# EAGLE schematic main_board_v1_2 (EAGLE 9.2.2)

## Sheet 1 of 8: MCU
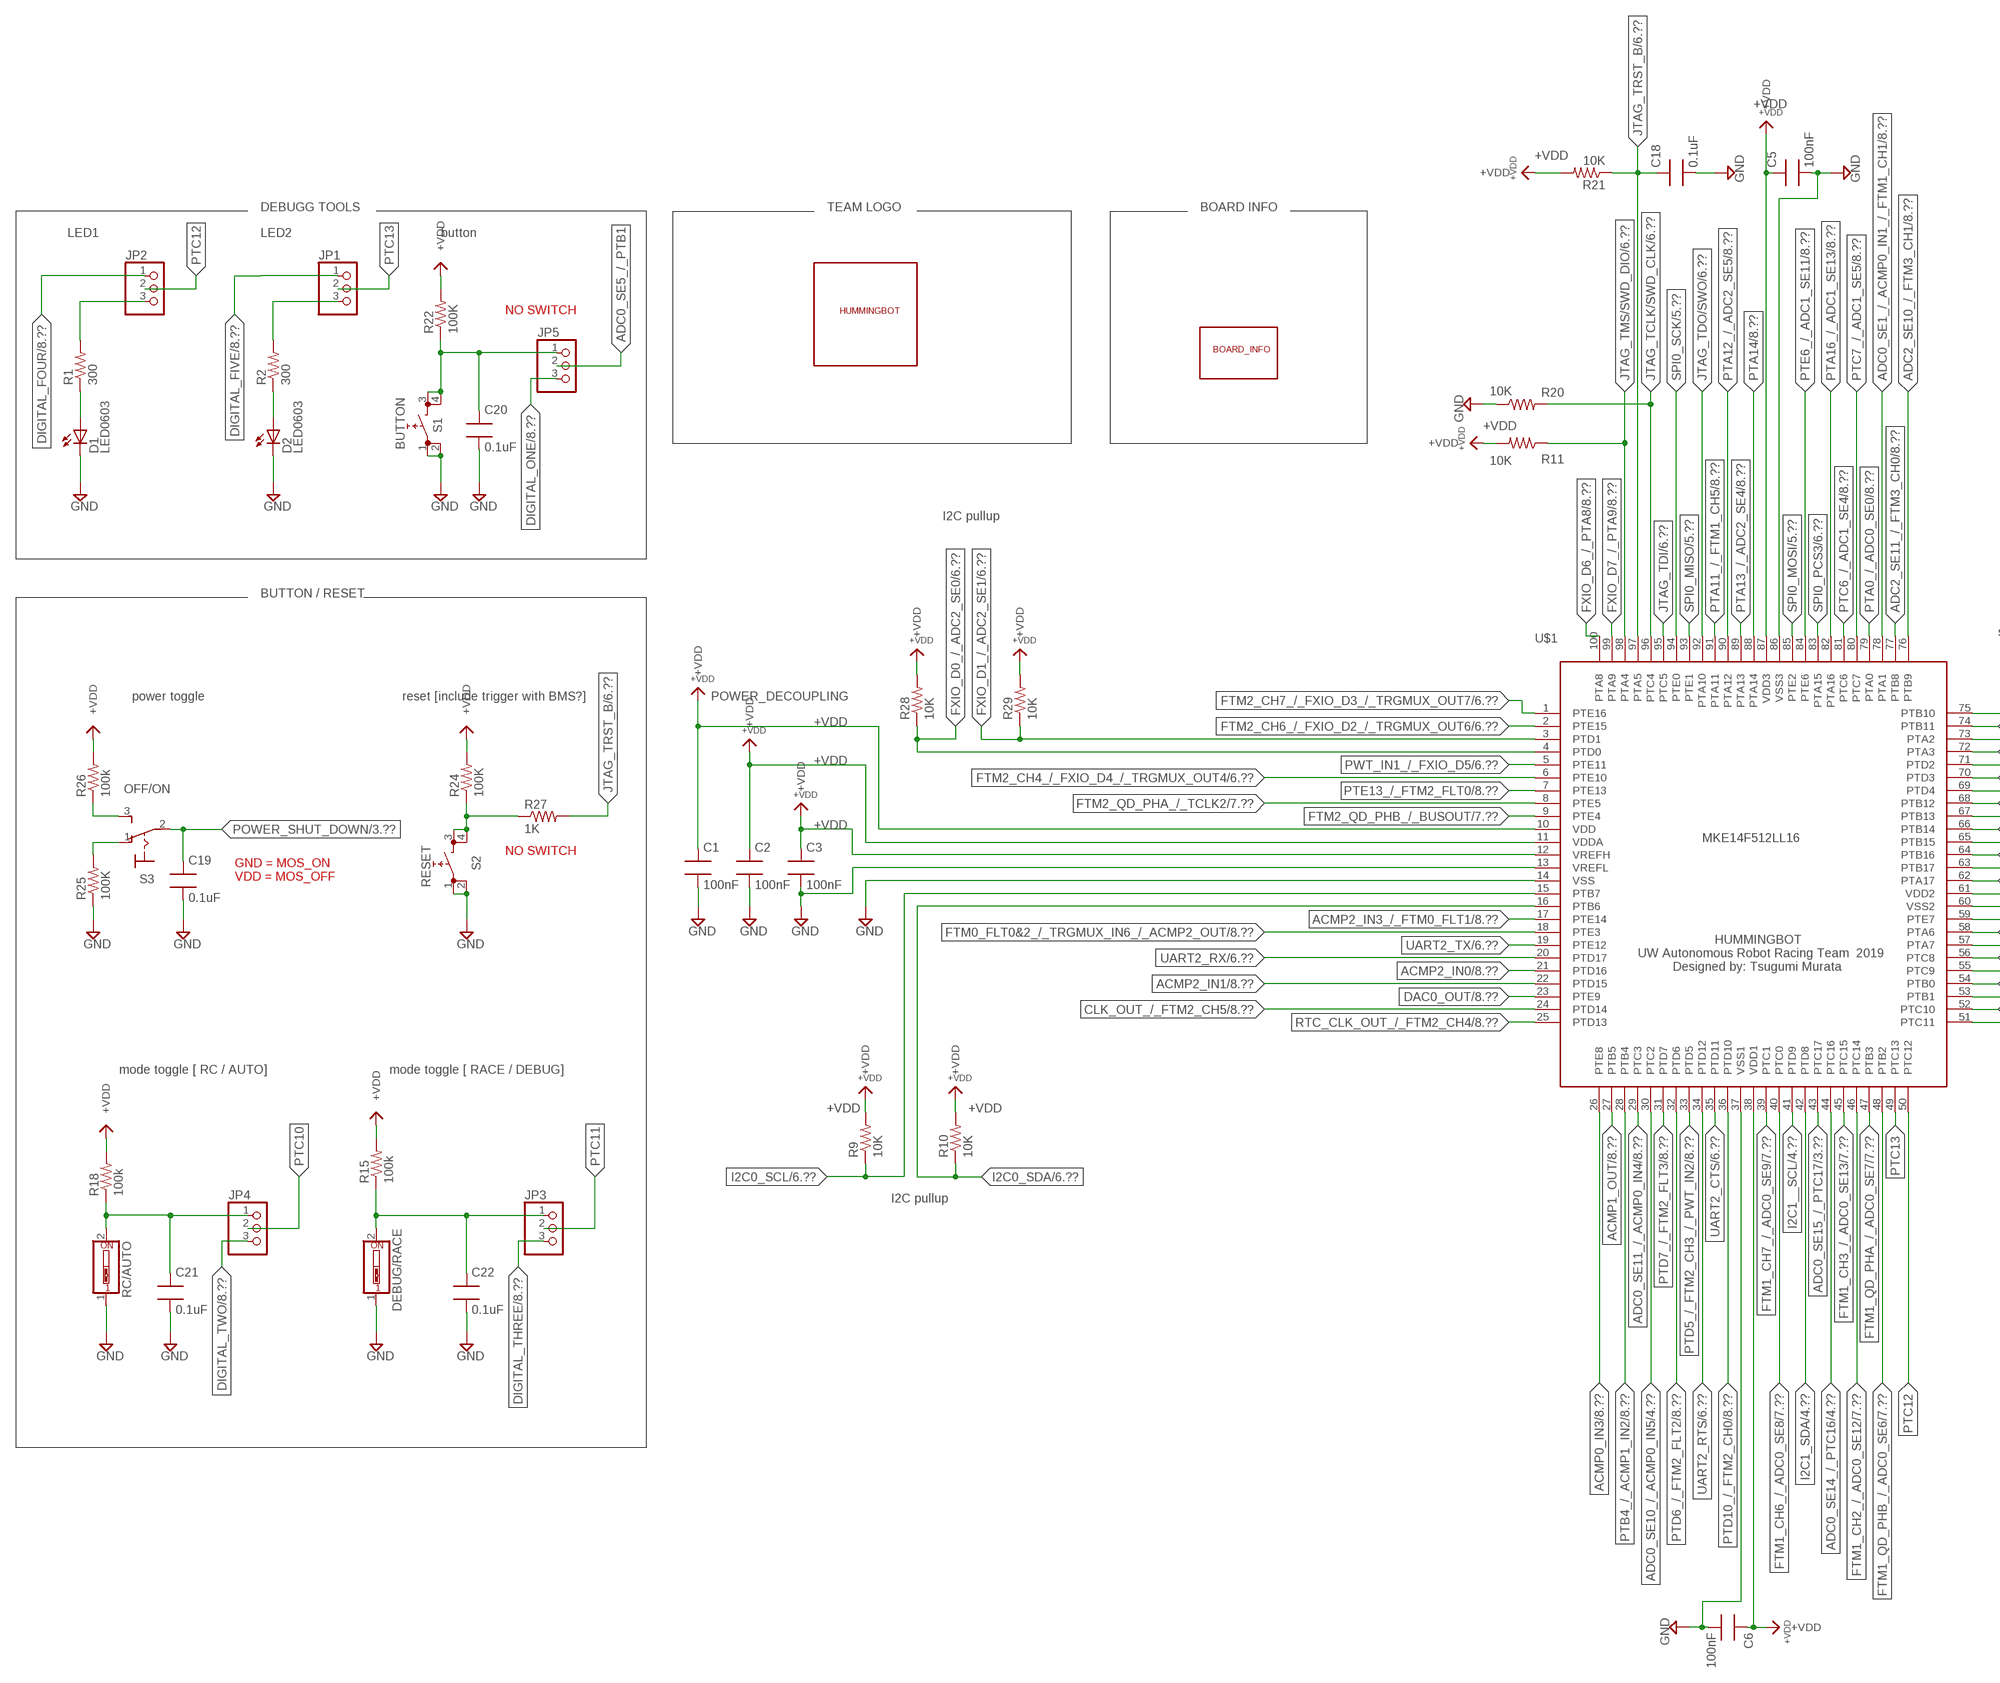
[diagram p0: schematic, sheet 1, part 1 of 2]
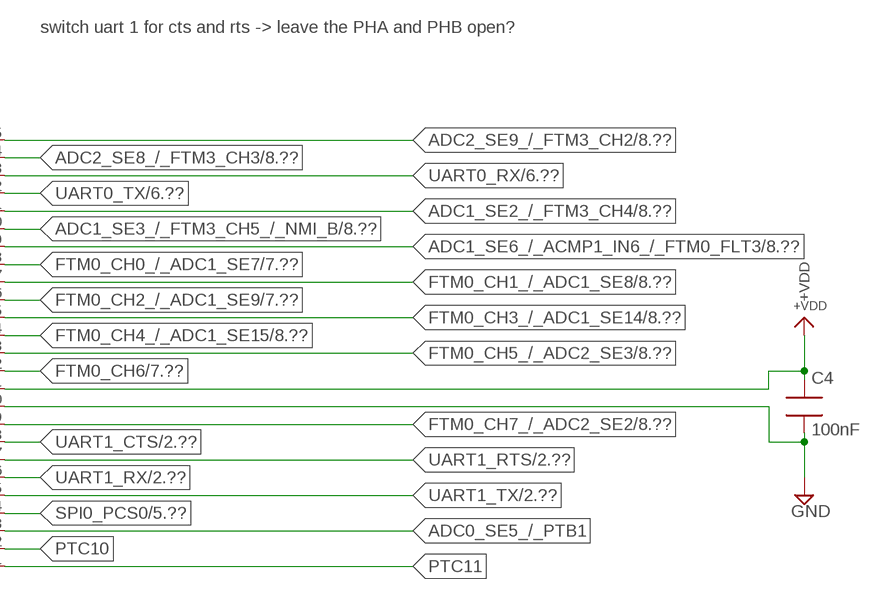
[diagram p1: schematic, sheet 1, part 2 of 2]

### Parts
C1  100nF  CAP0603  [0603SMT]
C2  100nF  CAP0603  [0603SMT]
C3  100nF  CAP0603  [0603SMT]
C4  100nF  CAP0603  [0603SMT]
C5  100nF  CAP0603  [0603SMT]
C6  100nF  CAP0603  [0603SMT]
C18  0.1uF  CAP0603  [0603SMT]
C19  0.1uF  CAP0603  [0603SMT]
C20  0.1uF  CAP0603  [0603SMT]
C21  0.1uF  CAP0603  [0603SMT]
C22  0.1uF  CAP0603  [0603SMT]
D1  LED0603  [0603SMT]
D2  LED0603  [0603SMT]
DEBUG/RACE  SW_DIP-1  [EDG-01]
JP1  PINHD-1X3  [1X03]
JP2  PINHD-1X3  [1X03]
JP3  PINHD-1X3  [1X03]
JP4  PINHD-1X3  [1X03]
JP5  PINHD-1X3  [1X03]
R1  300  RES0603  [0603SMT]
R2  300  RES0603  [0603SMT]
R9  10K  RES0603  [0603SMT]
R10  10K  RES0603  [0603SMT]
R11  10K  RES0603  [0603SMT]
R15  100k  RES0603  [0603SMT]
R18  100k  RES0603  [0603SMT]
R20  10K  RES0603  [0603SMT]
R21  10K  RES0603  [0603SMT]
R22  100K  RES0603  [0603SMT]
R24  100K  RES0603  [0603SMT]
R25  100K  RES0603  [0603SMT]
R26  100k  RES0603  [0603SMT]
R27  1K  RES0603  [0603SMT]
R28  10K  RES0603  [0603SMT]
R29  10K  RES0603  [0603SMT]
RC/AUTO  SW_DIP-1  [EDG-01]
S1  BUTTON  TACT_SWITCH_6X6_SMT  [TACT_SWITCH_SMT]
S2  RESET  TACT_SWITCH_6X6_SMT  [TACT_SWITCH_SMT]
S3  OFF/ON  M9040P  [M9040P]
U$1  MKE14F512LL16  [LQFP100]
U$38  BOARD_INFO  [BOARD_INFO]
U$44  TEAM_LOGO  [TEAM_LOGO]

### Nets
+VDD: C1.1 C2.1 C3.1 C4.1 C5.1 C6.1 R9.2 R10.2 R11.2 R15.2 R18.2 R21.2 R22.2 R24.2 R26.2 R28.2 R29.2 U$1.10(VDD) U$1.11(VDDA) U$1.12(VREFH) U$1.38(VDD1) U$1.61(VDD2) U$1.87(VDD3) ; also sheet 3,4,5,6,7,8
ACMP0_IN3: U$1.26(PTE8) ; also sheet 8
ACMP1_OUT: U$1.27(PTB5) ; also sheet 8
ACMP2_IN0: U$1.21(PTD16) ; also sheet 8
ACMP2_IN1: U$1.22(PTD15) ; also sheet 8
ACMP2_IN3_/_FTM0_FLT1: U$1.17(PTE14) ; also sheet 8
ADC0_SE1_/_ACMP0_IN1_/_FTM1_CH1: U$1.78(PTA1) ; also sheet 8
ADC0_SE5_/_PTB1: JP5.2 U$1.53(PTB1)
ADC0_SE10_/_ACMP0_IN5: U$1.30(PTC2) ; also sheet 4,8
ADC0_SE11_/_ACMP0_IN4: U$1.29(PTC3) ; also sheet 8
ADC0_SE14_/_PTC16: U$1.44(PTC16) ; also sheet 4,8
ADC0_SE15_/_PTC17: U$1.43(PTC17) ; also sheet 3,8
ADC1_SE2_/_FTM3_CH4: U$1.71(PTD2) ; also sheet 8
ADC1_SE3_/_FTM3_CH5_/_NMI_B: U$1.70(PTD3) ; also sheet 8
ADC1_SE6_/_ACMP1_IN6_/_FTM0_FLT3: U$1.69(PTD4) ; also sheet 8
ADC2_SE8_/_FTM3_CH3: U$1.74(PTB11) ; also sheet 8
ADC2_SE9_/_FTM3_CH2: U$1.75(PTB10) ; also sheet 8
ADC2_SE10_/_FTM3_CH1: U$1.76(PTB9) ; also sheet 8
ADC2_SE11_/_FTM3_CH0: U$1.77(PTB8) ; also sheet 8
CLK_OUT_/_FTM2_CH5: U$1.24(PTD14) ; also sheet 8
DAC0_OUT: U$1.23(PTE9) ; also sheet 8
DIGITAL_FIVE: JP1.1 ; also sheet 8
DIGITAL_FOUR: JP2.1 ; also sheet 8
DIGITAL_ONE: JP5.3 ; also sheet 8
DIGITAL_THREE: JP3.3 ; also sheet 8
DIGITAL_TWO: JP4.3 ; also sheet 8
FTM0_CH0_/_ADC1_SE7: U$1.68(PTB12) ; also sheet 7,8
FTM0_CH1_/_ADC1_SE8: U$1.67(PTB13) ; also sheet 8
FTM0_CH2_/_ADC1_SE9: U$1.66(PTB14) ; also sheet 7,8
FTM0_CH3_/_ADC1_SE14: U$1.65(PTB15) ; also sheet 8
FTM0_CH4_/_ADC1_SE15: U$1.64(PTB16) ; also sheet 8
FTM0_CH5_/_ADC2_SE3: U$1.63(PTB17) ; also sheet 8
FTM0_CH6: U$1.62(PTA17) ; also sheet 7,8
FTM0_CH7_/_ADC2_SE2: U$1.59(PTE7) ; also sheet 8
FTM0_FLT0&2_/_TRGMUX_IN6_/_ACMP2_OUT: U$1.18(PTE3) ; also sheet 8
FTM1_CH2_/_ADC0_SE12: U$1.46(PTC14) ; also sheet 7
FTM1_CH3_/_ADC0_SE13: U$1.45(PTC15) ; also sheet 7
FTM1_CH6_/_ADC0_SE8: U$1.40(PTC0) ; also sheet 7
FTM1_CH7_/_ADC0_SE9: U$1.39(PTC1) ; also sheet 7
FTM1_QD_PHA_/_ADC0_SE7: U$1.47(PTB3) ; also sheet 7
FTM1_QD_PHB_/_ADC0_SE6: U$1.48(PTB2) ; also sheet 7
FTM2_CH4_/_FXIO_D4_/_TRGMUX_OUT4: U$1.6(PTE10) ; also sheet 6,8
FTM2_CH6_/_FXIO_D2_/_TRGMUX_OUT6: U$1.2(PTE15) ; also sheet 6,8
FTM2_CH7_/_FXIO_D3_/_TRGMUX_OUT7: U$1.1(PTE16) ; also sheet 6,8
FTM2_QD_PHA_/_TCLK2: U$1.8(PTE5) ; also sheet 7
FTM2_QD_PHB_/_BUSOUT: U$1.9(PTE4) ; also sheet 7
FXIO_D0_/_ADC2_SE0: R28.1 U$1.4(PTD0) ; also sheet 6,8
FXIO_D1_/_ADC2_SE1: R29.1 U$1.3(PTD1) ; also sheet 6,8
FXIO_D6_/_PTA8: U$1.100(PTA8) ; also sheet 8
FXIO_D7_/_PTA9: U$1.99(PTA9) ; also sheet 8
GND: C1.2 C2.2 C3.2 C4.2 C5.2 C6.2 C18.2 C19.2 C20.2 C21.2 C22.2 D1.2(C) D2.2(C) DEBUG/RACE.1 R20.1 R25.1 RC/AUTO.1 S1.1 S1.2 S2.1 S2.2 U$1.13(VREFL) U$1.14(VSS) U$1.37(VSS1) U$1.60(VSS2) U$1.86(VSS3) ; also sheet 2,3,4,6,7,8
I2C0_SCL: R9.1 U$1.15(PTB7) ; also sheet 6
I2C0_SDA: R10.1 U$1.16(PTB6) ; also sheet 6
I2C1__SCL: U$1.41(PTD9) ; also sheet 4
I2C1_SDA: U$1.42(PTD8) ; also sheet 4
JTAG_TCLK/SWD_CLK: R20.2 U$1.96(PTC4) ; also sheet 6
JTAG_TDI: U$1.95(PTC5) ; also sheet 6
JTAG_TDO/SWO: U$1.92(PTA10) ; also sheet 6
JTAG_TMS/SWD_DIO: R11.1 U$1.98(PTA4) ; also sheet 6
JTAG_TRST_B: C18.1 R21.1 R27.2 U$1.97(PTA5) ; also sheet 6
N$3: D1.1(A) R1.1
N$5: D2.1(A) R2.1
N$6: JP1.3 R2.2
N$7: JP2.3 R1.2
N$19: R24.1 R27.1 S2.3 S2.4
N$26: C22.1 DEBUG/RACE.2 JP3.1 R15.1
N$31: C21.1 JP4.1 R18.1 RC/AUTO.2
N$41: C20.1 JP5.1 R22.1 S1.3 S1.4
N$45: R26.1 S3.3(S)
N$46: R25.2 S3.1(O)
POWER_SHUT_DOWN: C19.1 S3.2(P) ; also sheet 3
PTA0_/_ADC0_SE0: U$1.79(PTA0) ; also sheet 8
PTA11_/_FTM1_CH5: U$1.91(PTA11) ; also sheet 8
PTA12_/_ADC2_SE5: U$1.90(PTA12) ; also sheet 8
PTA13_/_ADC2_SE4: U$1.89(PTA13) ; also sheet 8
PTA14: U$1.88(PTA14) ; also sheet 8
PTA16_/_ADC1_SE13: U$1.82(PTA16) ; also sheet 8
PTB4_/_ACMP1_IN2: U$1.28(PTB4) ; also sheet 8
PTC6_/_ADC1_SE4: U$1.81(PTC6) ; also sheet 8
PTC7_/_ADC1_SE5: U$1.80(PTC7) ; also sheet 8
PTC10: JP4.2 U$1.52(PTC10)
PTC11: JP3.2 U$1.51(PTC11)
PTC12: JP2.2 U$1.50(PTC12)
PTC13: JP1.2 U$1.49(PTC13)
PTD5_/_FTM2_CH3_/_PWT_IN2: U$1.33(PTD5) ; also sheet 8
PTD6_/_FTM2_FLT2: U$1.32(PTD6) ; also sheet 8
PTD7_/_FTM2_FLT3: U$1.31(PTD7) ; also sheet 8
PTD10_/_FTM2_CH0: U$1.36(PTD10) ; also sheet 8
PTE6_/_ADC1_SE11: U$1.84(PTE6) ; also sheet 8
PTE13_/_FTM2_FLT0: U$1.7(PTE13) ; also sheet 8
PWT_IN1_/_FXIO_D5: U$1.5(PTE11) ; also sheet 6,8
RTC_CLK_OUT_/_FTM2_CH4: U$1.25(PTD13) ; also sheet 8
SPI0_MISO: U$1.93(PTE1) ; also sheet 5,6
SPI0_MOSI: U$1.85(PTE2) ; also sheet 5,6
SPI0_PCS0: U$1.54(PTB0) ; also sheet 5
SPI0_PCS3: U$1.83(PTA15) ; also sheet 6
SPI0_SCK: U$1.94(PTE0) ; also sheet 5,6
UART0_RX: U$1.73(PTA2) ; also sheet 6
UART0_TX: U$1.72(PTA3) ; also sheet 6
UART1_CTS: U$1.58(PTA6) ; also sheet 2
UART1_RTS: U$1.57(PTA7) ; also sheet 2
UART1_RX: U$1.56(PTC8) ; also sheet 2
UART1_TX: U$1.55(PTC9) ; also sheet 2
UART2_CTS: U$1.35(PTD11) ; also sheet 6
UART2_RTS: U$1.34(PTD12) ; also sheet 6
UART2_RX: U$1.20(PTD17) ; also sheet 6
UART2_TX: U$1.19(PTE12) ; also sheet 6

### Notes on the sheet
- DEBUGG TOOLS | TEAM LOGO | BOARD INFO
- LED1 | LED2 | button
- NO SWITCH
- I2C pullup
- BUTTON / RESET
- switch uart 1 for cts and rts -> leave the PHA and PHB open?
- power toggle | reset [include trigger with BMS?] | POWER_DECOUPLING
- NO SWITCH
- GND = MOS_ON 
  VDD = MOS_OFF
- HUMMINGBOT 
  UW Autonomous Robot Racing Team  2019 
            Designed by: Tsugumi Murata
- mode toggle [ RC / AUTO] | mode toggle [ RACE / DEBUG]
- I2C pullup

## Sheet 2 of 8: USB Interface [Programming / Debug]
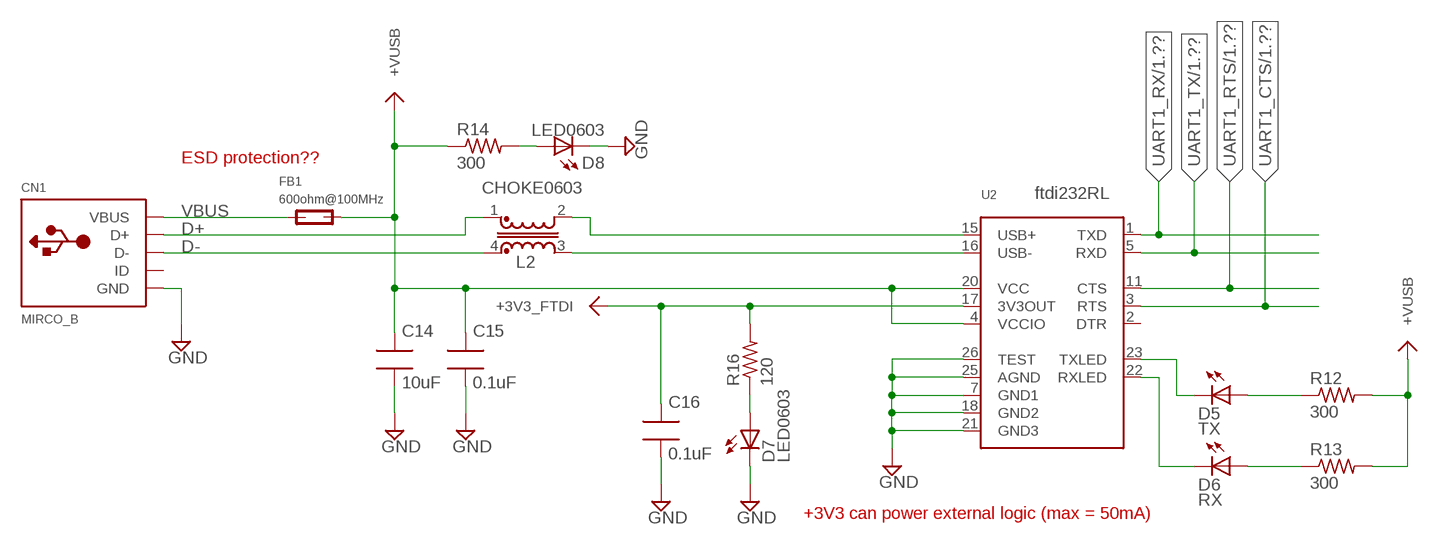
[diagram p2: schematic, sheet 2]

### Parts
C14  10uF  CAP0603  [0603SMT]
C15  0.1uF  CAP0603  [0603SMT]
C16  0.1uF  CAP0603  [0603SMT]
CN1  MIRCO_B  [MICRO-USB]
D5  TX  LED0603  [0603SMT]
D6  RX  LED0603  [0603SMT]
D7  LED0603  [0603SMT]
D8  LED0603  [0603SMT]
FB1  600ohm@100MHz  FERRITE_BEAD  [0603SMT]
L2  CHOKE0603  [CHOKE0603]
R12  300  RES0603  [0603SMT]
R13  300  RES0603  [0603SMT]
R14  300  RES0603  [0603SMT]
R16  120  RES0603  [0603SMT]
U2  FT232RLSSOP28  [SSOP28DB]

### Nets
+3V3_FTDI: C16.1 R16.2 U2.17(3V3OUT)
+VUSB: C14.1 C15.1 FB1.2 R12.2 R13.2 R14.1 U2.4(VCCIO) U2.20(VCC)
D+: CN1.3(D+) L2.1
D-: CN1.2(D-) L2.4
GND: C14.2 C15.2 C16.2 CN1.5(GND) CN1.GND1(GND) CN1.GND2(GND) D7.2(C) D8.2(C) U2.7(GND1) U2.18(GND2) U2.21(GND3) U2.25(AGND) U2.26(TEST) ; also sheet 1,3,4,6,7,8
N$1: D7.1(A) R16.1
N$2: D8.1(A) R14.2
N$12: L2.2 U2.15(USB+)
N$13: L2.3 U2.16(USB-)
N$14: D5.2(C) U2.23(TXLED)
N$15: D5.1(A) R12.1
N$17: D6.2(C) U2.22(RXLED)
N$18: D6.1(A) R13.1
UART1_CTS: U2.3(RTS) ; also sheet 1
UART1_RTS: U2.11(CTS) ; also sheet 1
UART1_RX: U2.1(TXD) ; also sheet 1
UART1_TX: U2.5(RXD) ; also sheet 1
VBUS: CN1.1(VBUS) FB1.1
Unconnected: CN1.4(ID) U2.2(DTR)

### Notes on the sheet
- ESD protection??
- ftdi232RL
- +3V3 can power external logic (max = 50mA)

## Sheet 3 of 8: POWER REGULATOR / SHUTDOWN
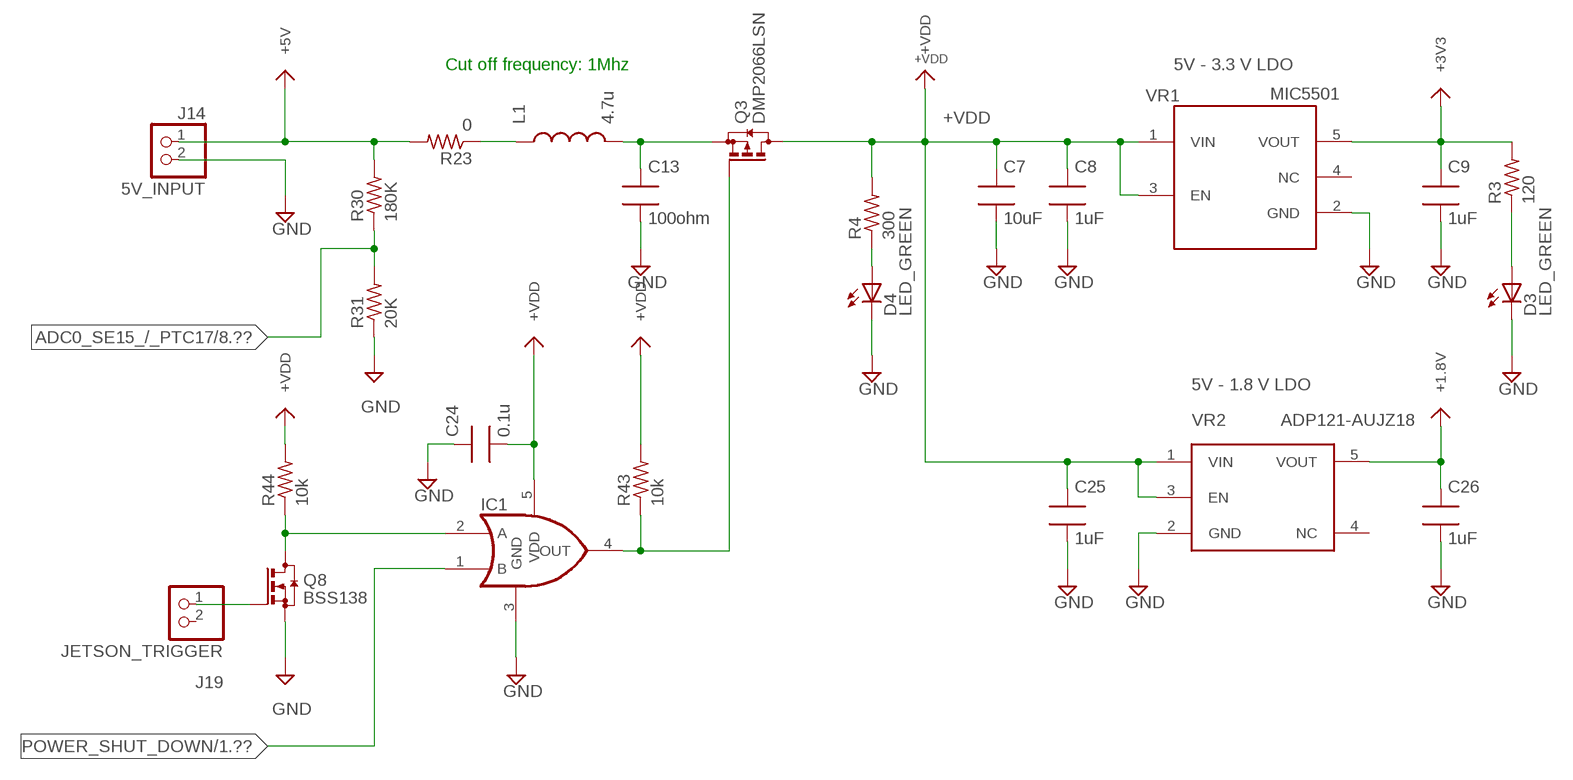
[diagram p3: schematic, sheet 3]

### Parts
C7  10uF  CAP0603  [0603SMT]
C8  1uF  CAP0603  [0603SMT]
C9  1uF  CAP0603  [0603SMT]
C13  100ohm  CAP0603  [0603SMT]
C24  0.1u  CAP0603  [0603SMT]
C25  1uF  CAP0603  [0603SMT]
C26  1uF  CAP0603  [0603SMT]
D3  LED_GREEN  LED0603  [0603SMT]
D4  LED_GREEN  LED0603  [0603SMT]
IC1  OR_SC70-5  [SC70-5]
J14  5V_INPUT  PINHEAD-2-VERTICAL  [JST_B2B-PH-K-S(LF)(SN)]
J19  JETSON_TRIGGER  PINHEAD-2-VERTICAL  [JST_B2B-PH-K-S(LF)(SN)]
L1  4.7u  IND0603  [0603SMT]
Q3  DMP2066LSN  PMOS_SOT23  [SOT23]
Q8  BSS138  NMOS_SOT23  [SOT23]
R3  120  RES0603  [0603SMT]
R4  300  RES0603  [0603SMT]
R23  0  RES0603  [0603SMT]
R30  180K  RES0603  [0603SMT]
R31  20K  RES0603  [0603SMT]
R43  10k  RES0603  [0603SMT]
R44  10k  RES0603  [0603SMT]
VR1  MIC5501  [SOT23-5]
VR2  ADP121-AUJZ18  ADP121  [TSOT23-5]

### Nets
+1.8V: C26.1 VR2.5(VOUT) ; supply symbol labelled +1V8 ; also sheet 4,6,8
+3V3: C9.1 R3.2 VR1.5(VOUT) ; also sheet 5,6,8
+5V: J14.1 R23.2 R30.2 ; also sheet 7
+VDD: C7.1 C8.1 C24.2 C25.1 IC1.5(VDD) Q3.3(D) R4.2 R43.2 R44.2 VR1.1(VIN) VR1.3(EN) VR2.1(VIN) VR2.3(EN) ; also sheet 1,4,5,6,7,8
ADC0_SE15_/_PTC17: R30.1 R31.2 ; also sheet 1,8
GND: C7.2 C8.2 C9.2 C13.2 C24.1 C25.2 C26.2 D3.2(C) D4.2(C) IC1.3(GND) J14.2 Q8.2(S) R31.1 VR1.2(GND) VR2.2(GND) ; also sheet 1,2,4,6,7,8
N$8: D3.1(A) R3.1
N$9: D4.1(A) R4.1
N$11: L1.1 R23.1
N$20: C13.1 L1.2 Q3.2(S)
N$35: J19.1 Q8.1(G)
N$38: IC1.2(A) Q8.3(D) R44.1
N$39: IC1.4(OUT) Q3.1(G) R43.1
POWER_SHUT_DOWN: IC1.1(B) ; also sheet 1
Unconnected: J19.2 VR1.4(NC) VR2.4(NC)

### Notes on the sheet
- Cut off frequency: 1Mhz | 5V - 3.3 V LDO
- 5V - 1.8 V LDO

## Sheet 4 of 8: IMU / Bi- Directional Level Shifter
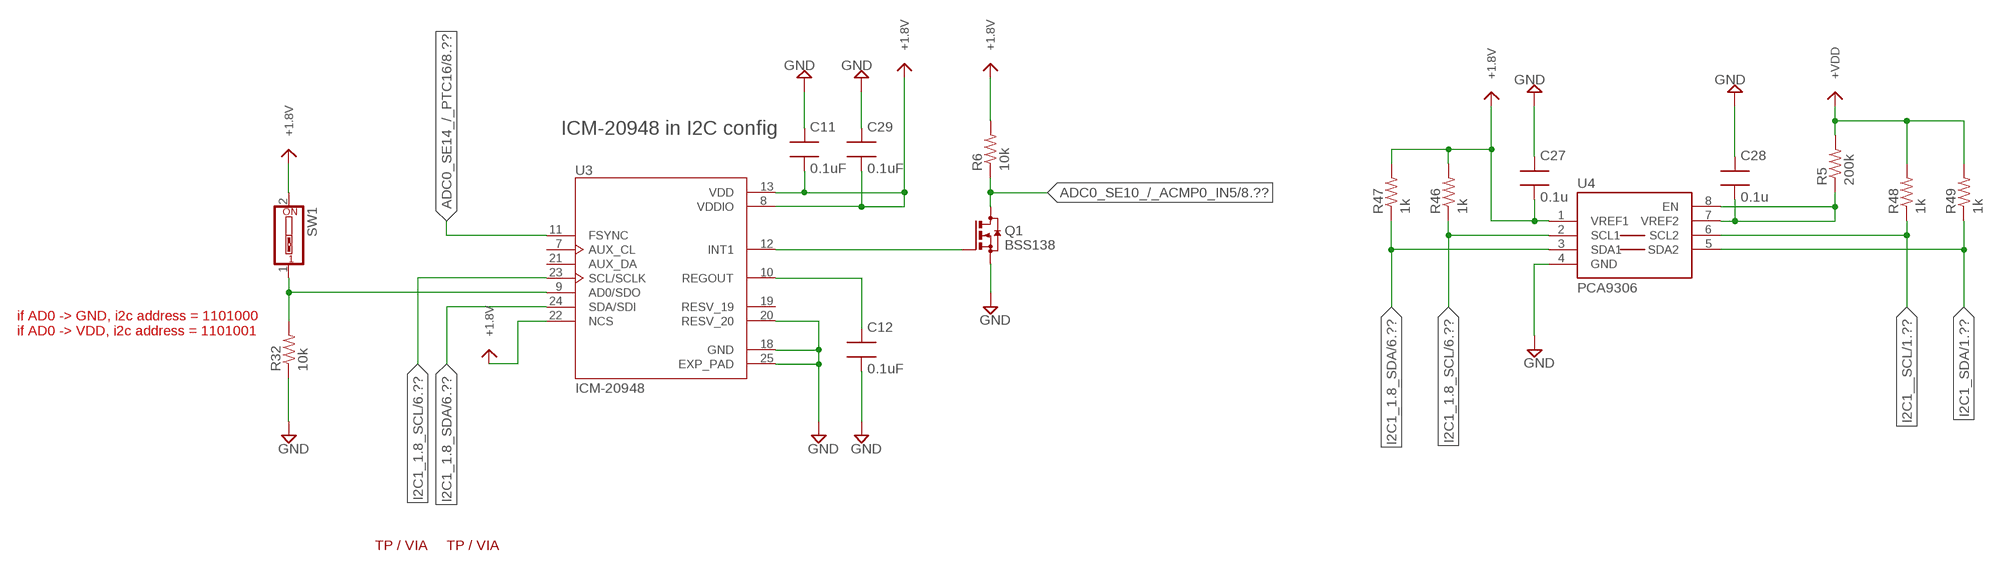
[diagram p4: schematic, sheet 4]

### Parts
C11  0.1uF  CAP0603  [0603SMT]
C12  0.1uF  CAP0603  [0603SMT]
C27  0.1u  CAP0603  [0603SMT]
C28  0.1u  CAP0603  [0603SMT]
C29  0.1uF  CAP0603  [0603SMT]
Q1  BSS138  NMOS_SOT23  [SOT23]
R5  200k  RES0603  [0603SMT]
R6  10k  RES0603  [0603SMT]
R32  10k  RES0603  [0603SMT]
R46  1k  RES0603  [0603SMT]
R47  1k  RES0603  [0603SMT]
R48  1k  RES0603  [0603SMT]
R49  1k  RES0603  [0603SMT]
SW1  SW_DIP-1  [EDG-01]
U3  ICM-20948  [QFN40P300X300X105-25N]
U4  PCA9306  [PSOP-8]

### Nets
+1.8V: C11.2 C27.2 C29.2 R6.2 R46.2 R47.2 SW1.2 U3.8(VDDIO) U3.13(VDD) U3.22(NCS) U4.1(VREF1) ; supply symbol labelled +1V8 ; also sheet 3,6,8
+VDD: R5.2 R48.2 R49.2 ; also sheet 1,3,5,6,7,8
ADC0_SE10_/_ACMP0_IN5: Q1.3(D) R6.1 ; also sheet 1,8
ADC0_SE14_/_PTC16: U3.11(FSYNC) ; also sheet 1,8
GND: C11.1 C12.2 C27.1 C28.1 C29.1 Q1.2(S) R32.1 U3.18(GND) U3.20(RESV_20) U3.25(EXP_PAD) U4.4(GND) ; also sheet 1,2,3,6,7,8
I2C1_1.8_SCL: R46.1 U3.23(SCL/SCLK) U4.2(SCL1) ; also sheet 6
I2C1_1.8_SDA: R47.1 U3.24(SDA/SDI) U4.3(SDA1) ; also sheet 6
I2C1__SCL: R48.1 U4.6(SCL2) ; also sheet 1
I2C1_SDA: R49.1 U4.5(SDA2) ; also sheet 1
N$10: C12.1 U3.10(REGOUT)
N$16: C28.2 R5.1 U4.7(VREF2) U4.8(EN)
N$22: R32.2 SW1.1 U3.9(AD0/SDO)
N$37: Q1.1(G) U3.12(INT1)
Unconnected: U3.7(AUX_CL) U3.19(RESV_19) U3.21(AUX_DA)

### Notes on the sheet
- ICM-20948 in I2C config
- if AD0 -> GND, i2c address = 1101000
  if AD0 -> VDD, i2c address = 1101001
- TP / VIA | TP / VIA

## Sheet 5 of 8: SPI Bi-directional level shifter
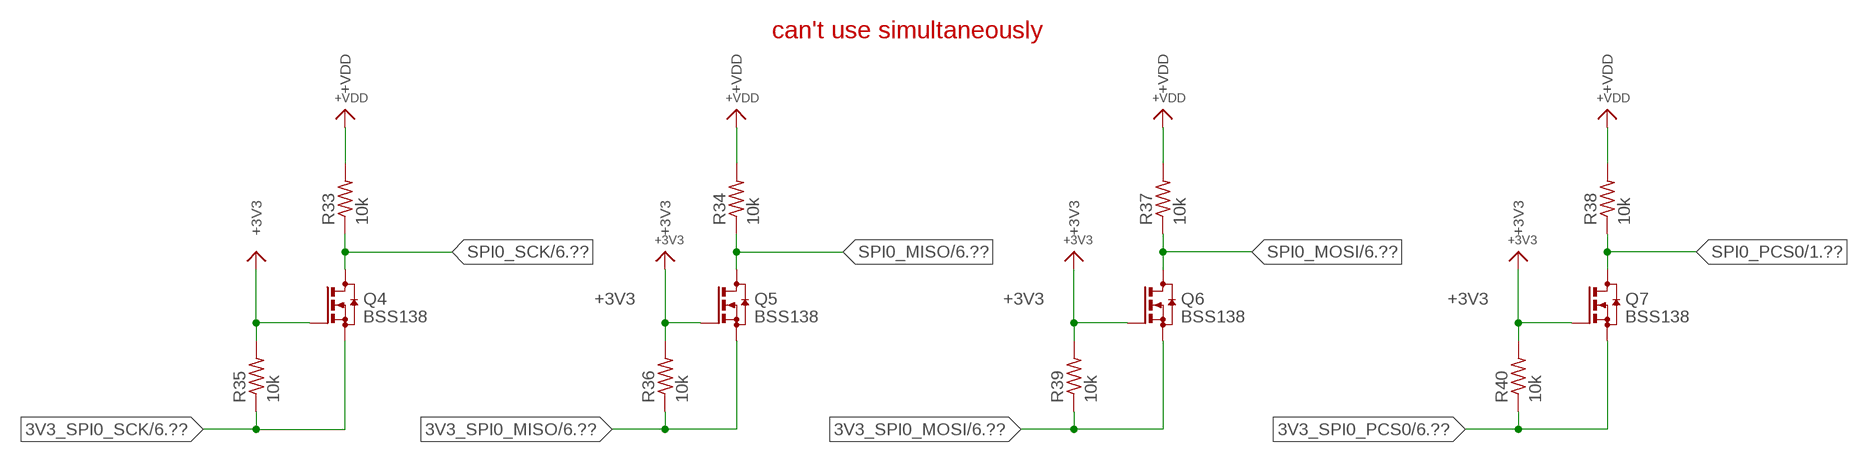
[diagram p5: schematic, sheet 5]

### Parts
Q4  BSS138  NMOS_SOT23  [SOT23]
Q5  BSS138  NMOS_SOT23  [SOT23]
Q6  BSS138  NMOS_SOT23  [SOT23]
Q7  BSS138  NMOS_SOT23  [SOT23]
R33  10k  RES0603  [0603SMT]
R34  10k  RES0603  [0603SMT]
R35  10k  RES0603  [0603SMT]
R36  10k  RES0603  [0603SMT]
R37  10k  RES0603  [0603SMT]
R38  10k  RES0603  [0603SMT]
R39  10k  RES0603  [0603SMT]
R40  10k  RES0603  [0603SMT]

### Nets
3V3_SPI0_MISO: Q5.2(S) R36.1 ; also sheet 6
3V3_SPI0_MOSI: Q6.2(S) R39.1 ; also sheet 6
3V3_SPI0_PCS0: Q7.2(S) R40.1 ; also sheet 6
3V3_SPI0_SCK: Q4.2(S) R35.1 ; also sheet 6
+3V3: Q4.1(G) Q5.1(G) Q6.1(G) Q7.1(G) R35.2 R36.2 R39.2 R40.2 ; also sheet 3,6,8
+VDD: R33.2 R34.2 R37.2 R38.2 ; also sheet 1,3,4,6,7,8
SPI0_MISO: Q5.3(D) R34.1 ; also sheet 1,6
SPI0_MOSI: Q6.3(D) R37.1 ; also sheet 1,6
SPI0_PCS0: Q7.3(D) R38.1 ; also sheet 1
SPI0_SCK: Q4.3(D) R33.1 ; also sheet 1,6

### Notes on the sheet
- can't use simultaneously

## Sheet 6 of 8: Communication ( I2C / SPI / UART / SWD / JTAG )
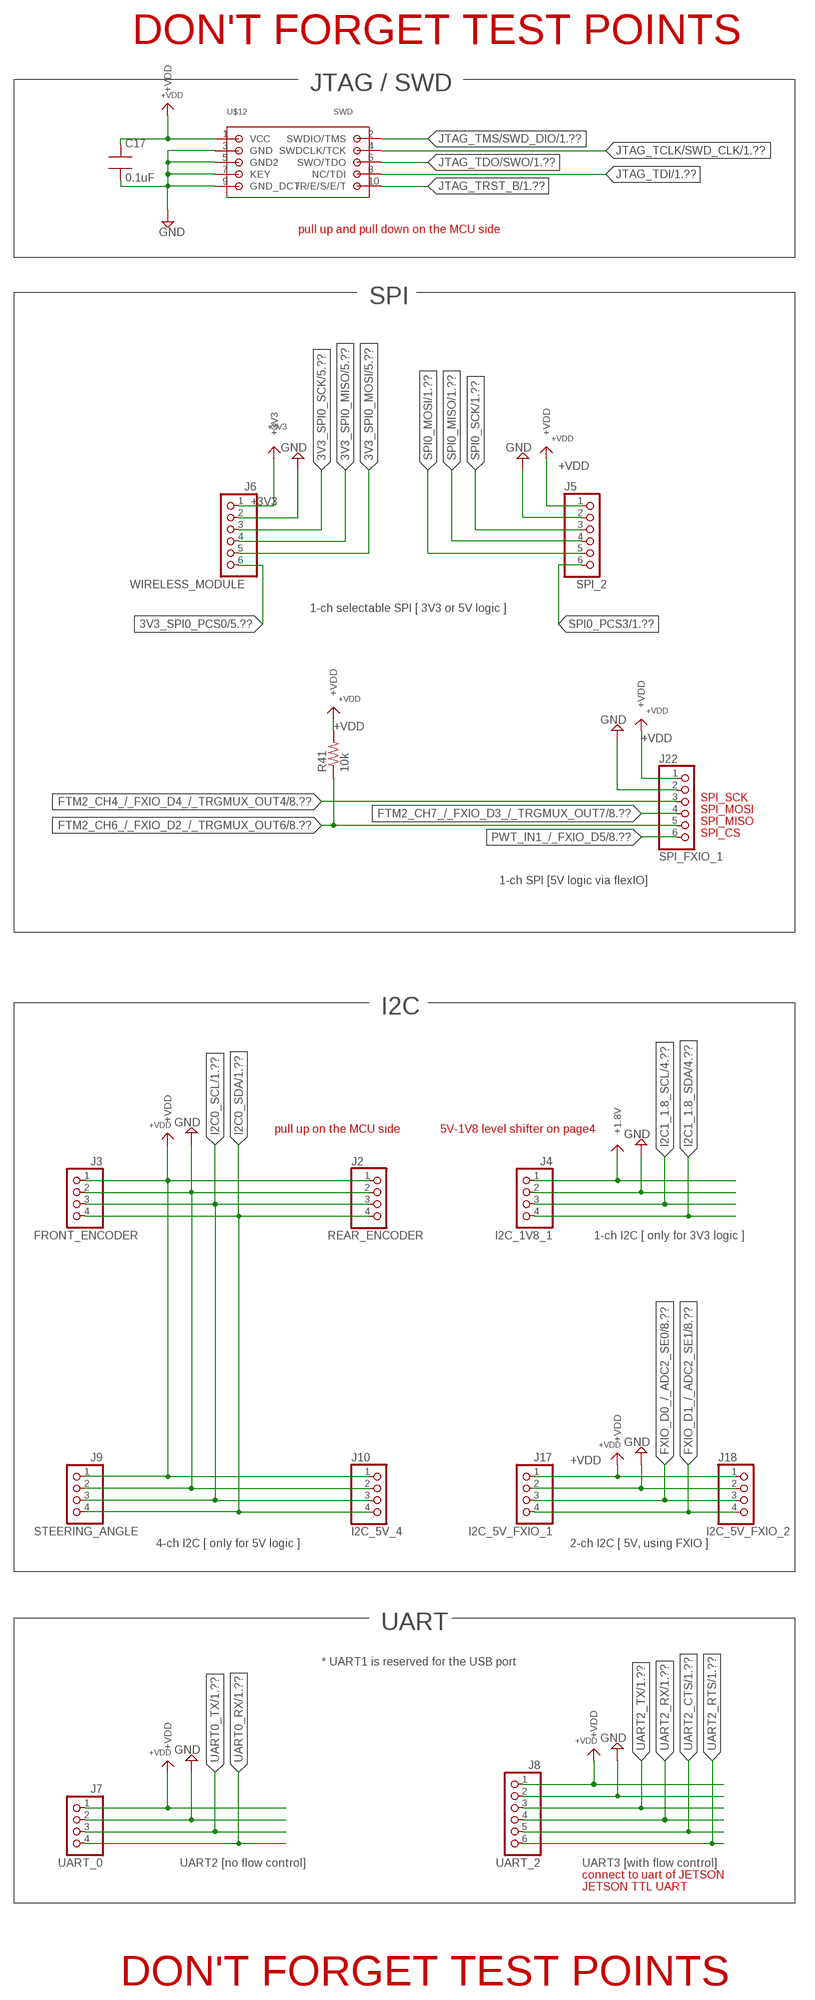
[diagram p6: schematic, sheet 6]

### Parts
C17  0.1uF  CAP0603  [0603SMT]
J2  REAR_ENCODER  PINHEAD-4-VERTICAL  [JST_B4B-PH-K-S(LF)(SN)]
J3  FRONT_ENCODER  PINHEAD-4-VERTICAL  [JST_B4B-PH-K-S(LF)(SN)]
J4  I2C_1V8_1  PINHEAD-4-VERTICAL  [JST_B4B-PH-K-S(LF)(SN)]
J5  SPI_2  PINHEAD-6-VERTICAL  [JST_B6B-PH-K-S(LF)(SN)]
J6  WIRELESS_MODULE  PINHEAD-6-VERTICAL  [JST_B6B-PH-K-S(LF)(SN)]
J7  UART_0  PINHEAD-4-VERTICAL  [JST_B4B-PH-K-S(LF)(SN)]
J8  UART_2  PINHEAD-6-VERTICAL  [JST_B6B-PH-K-S(LF)(SN)]
J9  STEERING_ANGLE  PINHEAD-4-VERTICAL  [JST_B4B-PH-K-S(LF)(SN)]
J10  I2C_5V_4  PINHEAD-4-VERTICAL  [JST_B4B-PH-K-S(LF)(SN)]
J17  I2C_5V_FXIO_1  PINHEAD-4-VERTICAL  [JST_B4B-PH-K-S(LF)(SN)]
J18  I2C_5V_FXIO_2  PINHEAD-4-VERTICAL  [JST_B4B-PH-K-S(LF)(SN)]
J22  SPI_FXIO_1  PINHEAD-6-VERTICAL  [JST_B6B-PH-K-S(LF)(SN)]
R41  10k  RES0603  [0603SMT]
U$12  SWD  SWD_1.27MM  [SWD_1.27MM]

### Nets
3V3_SPI0_MISO: J6.4 ; also sheet 5
3V3_SPI0_MOSI: J6.5 ; also sheet 5
3V3_SPI0_PCS0: J6.6 ; also sheet 5
3V3_SPI0_SCK: J6.3 ; also sheet 5
+1.8V: J4.1 ; supply symbol labelled +1V8 ; also sheet 3,4,8
+3V3: J6.1 ; also sheet 3,5,8
+VDD: C17.1 J2.1 J3.1 J5.1 J7.1 J8.1 J9.1 J10.1 J17.1 J18.1 J22.1 R41.2 U$12.1(VCC) ; also sheet 1,3,4,5,7,8
FTM2_CH4_/_FXIO_D4_/_TRGMUX_OUT4: J22.3 ; also sheet 1,8
FTM2_CH6_/_FXIO_D2_/_TRGMUX_OUT6: J22.5 R41.1 ; also sheet 1,8
FTM2_CH7_/_FXIO_D3_/_TRGMUX_OUT7: J22.4 ; also sheet 1,8
FXIO_D0_/_ADC2_SE0: J17.3 J18.3 ; also sheet 1,8
FXIO_D1_/_ADC2_SE1: J17.4 J18.4 ; also sheet 1,8
GND: C17.2 J2.2 J3.2 J4.2 J5.2 J6.2 J7.2 J8.2 J9.2 J10.2 J17.2 J18.2 J22.2 U$12.3(GND) U$12.5(GND2) U$12.7(KEY) U$12.9(GND_DCT) ; also sheet 1,2,3,4,7,8
I2C0_SCL: J2.3 J3.3 J9.3 J10.3 ; also sheet 1
I2C0_SDA: J2.4 J3.4 J9.4 J10.4 ; also sheet 1
I2C1_1.8_SCL: J4.3 ; also sheet 4
I2C1_1.8_SDA: J4.4 ; also sheet 4
JTAG_TCLK/SWD_CLK: U$12.4(SWDCLK/TCK) ; also sheet 1
JTAG_TDI: U$12.8(NC/TDI) ; also sheet 1
JTAG_TDO/SWO: U$12.6(SWO/TDO) ; also sheet 1
JTAG_TMS/SWD_DIO: U$12.2(SWDIO/TMS) ; also sheet 1
JTAG_TRST_B: U$12.10(/R/E/S/E/T) ; also sheet 1
PWT_IN1_/_FXIO_D5: J22.6 ; also sheet 1,8
SPI0_MISO: J5.4 ; also sheet 1,5
SPI0_MOSI: J5.5 ; also sheet 1,5
SPI0_PCS3: J5.6 ; also sheet 1
SPI0_SCK: J5.3 ; also sheet 1,5
UART0_RX: J7.4 ; also sheet 1
UART0_TX: J7.3 ; also sheet 1
UART2_CTS: J8.5 ; also sheet 1
UART2_RTS: J8.6 ; also sheet 1
UART2_RX: J8.4 ; also sheet 1
UART2_TX: J8.3 ; also sheet 1

### Notes on the sheet
- DON'T FORGET TEST POINTS
- JTAG / SWD
- pull up and pull down on the MCU side
- SPI
- 1-ch selectable SPI [ 3V3 or 5V logic ]
- SPI_SCK
- SPI_MOSI
- SPI_MISO
- SPI_CS
- 1-ch SPI [5V logic via flexIO]
- I2C
- pull up on the MCU side | 5V-1V8 level shifter on page4
- 1-ch I2C [ only for 3V3 logic ]
- 4-ch I2C [ only for 5V logic ] | 2-ch I2C [ 5V, using FXIO ]
- UART
- * UART1 is reserved for the USB port
- UART2 [no flow control] | UART3 [with flow control]
- connect to uart of JETSON
- JETSON TTL UART
- DON'T FORGET TEST POINTS

## Sheet 7 of 8: SENSOR / ACTUATOR
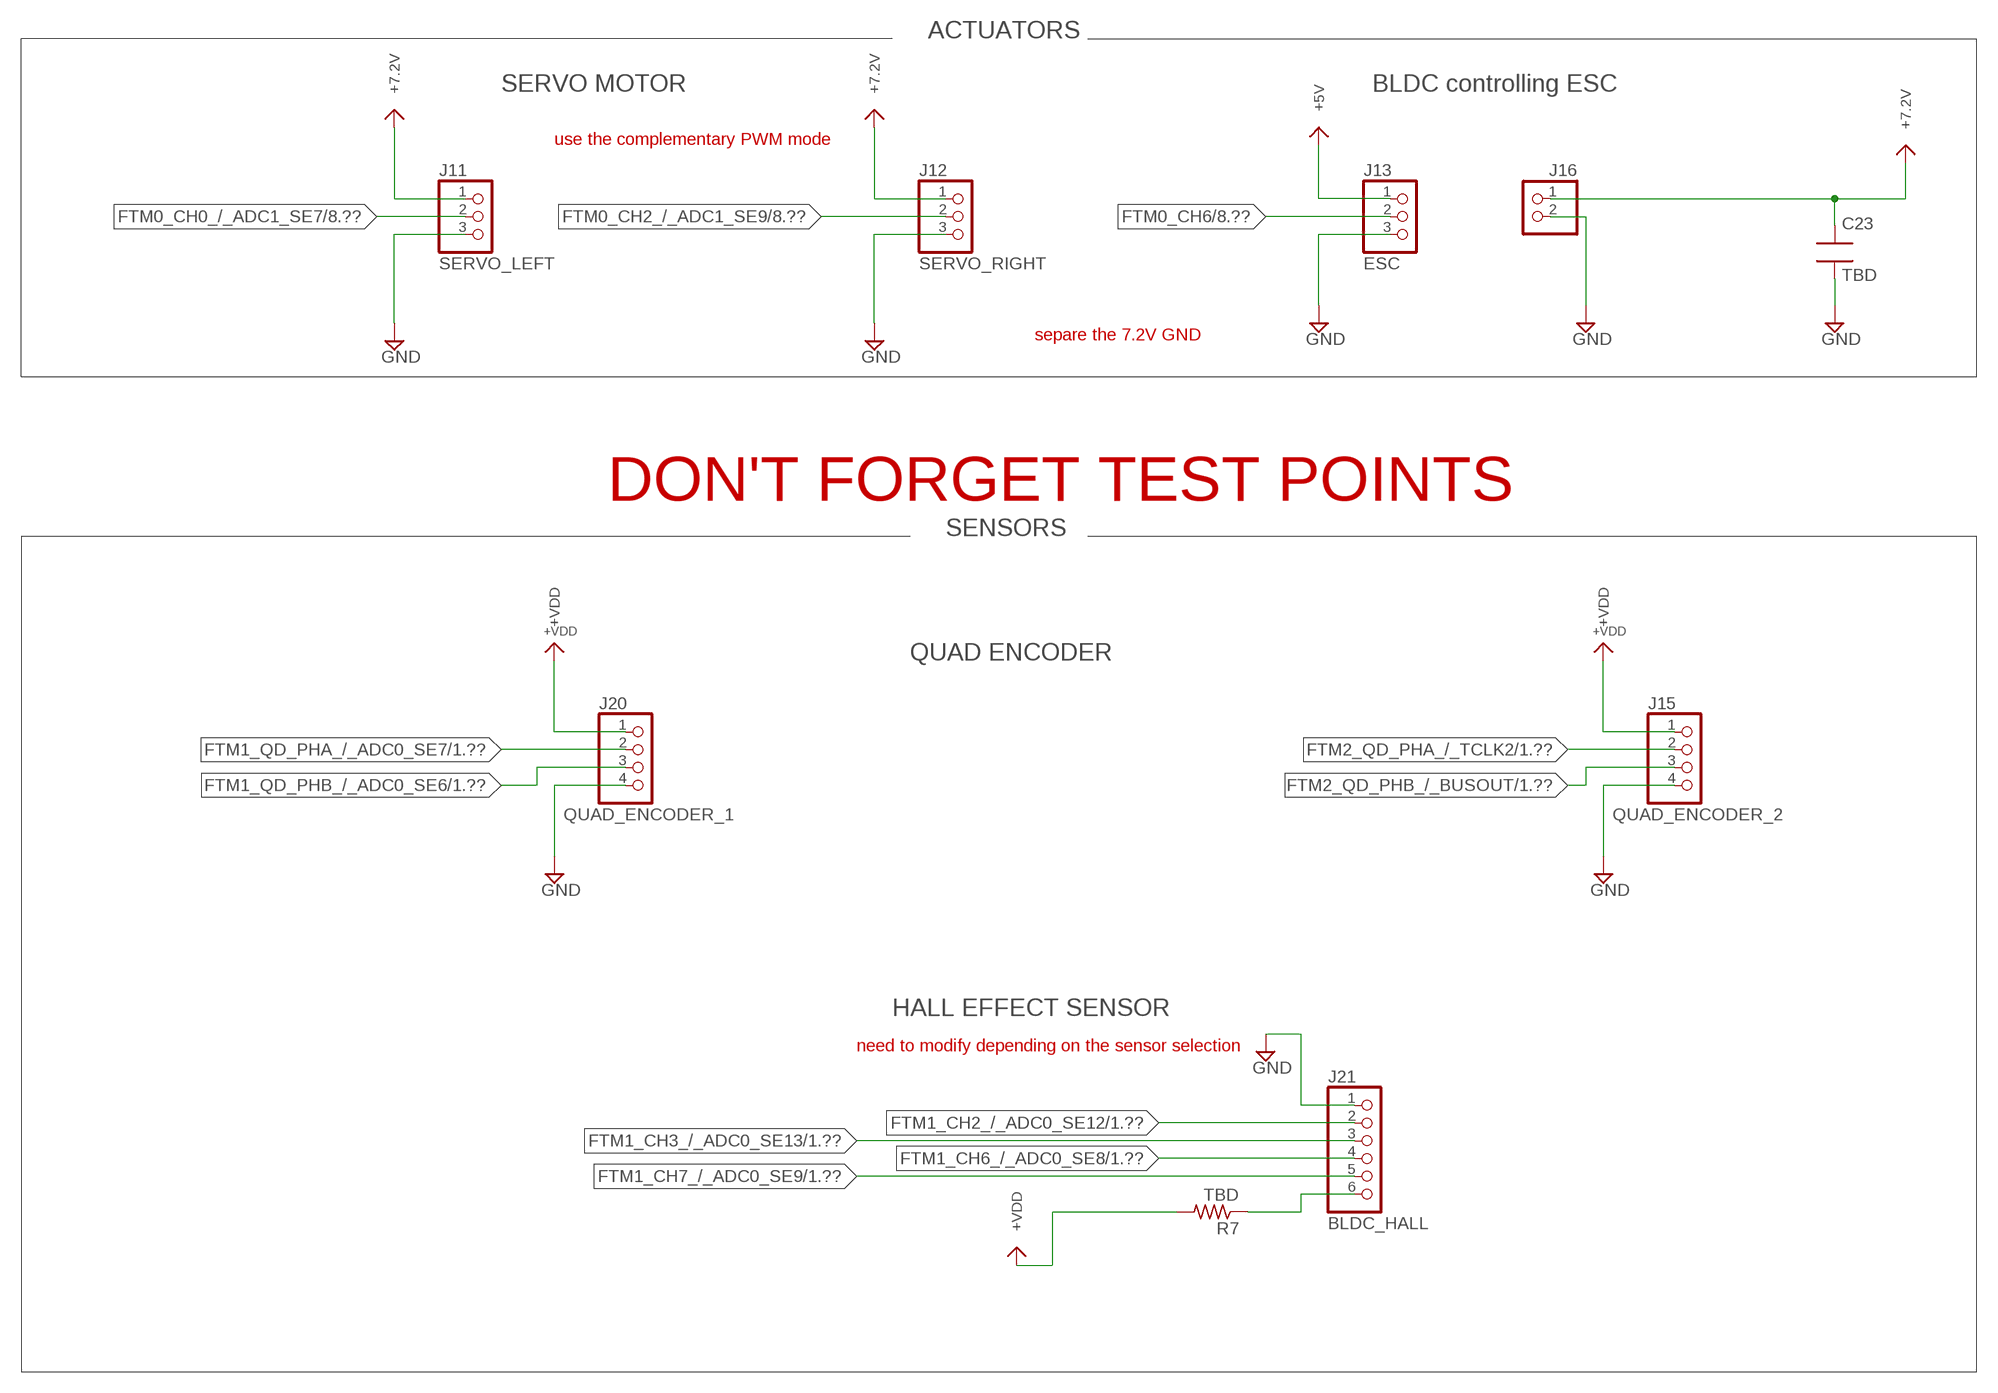
[diagram p7: schematic, sheet 7]

### Parts
C23  TBD  CAP0603  [0603SMT]
J11  SERVO_LEFT  PINHEAD-3-VERTICAL  [JST_B3B-PH-K-S(LF)(SN)]
J12  SERVO_RIGHT  PINHEAD-3-VERTICAL  [JST_B3B-PH-K-S(LF)(SN)]
J13  ESC  PINHEAD-3-VERTICAL  [JST_B3B-PH-K-S(LF)(SN)]
J15  QUAD_ENCODER_2  PINHEAD-4-VERTICAL  [JST_B4B-PH-K-S(LF)(SN)]
J16  7.2V_INPUT  PINHEAD-2-VERTICAL  [JST_B2B-PH-K-S(LF)(SN)]
J20  QUAD_ENCODER_1  PINHEAD-4-VERTICAL  [JST_B4B-PH-K-S(LF)(SN)]
J21  BLDC_HALL  PINHEAD-6-VERTICAL  [JST_B6B-PH-K-S(LF)(SN)]
R7  TBD  RES0603  [0603SMT]

### Nets
+5V: J13.1 ; also sheet 3
+7.2V: C23.1 J11.1 J12.1 J16.1 ; supply symbol labelled +7V2
+VDD: J15.1 J20.1 R7.2 ; also sheet 1,3,4,5,6,8
FTM0_CH0_/_ADC1_SE7: J11.2 ; also sheet 1,8
FTM0_CH2_/_ADC1_SE9: J12.2 ; also sheet 1,8
FTM0_CH6: J13.2 ; also sheet 1,8
FTM1_CH2_/_ADC0_SE12: J21.2 ; also sheet 1
FTM1_CH3_/_ADC0_SE13: J21.3 ; also sheet 1
FTM1_CH6_/_ADC0_SE8: J21.4 ; also sheet 1
FTM1_CH7_/_ADC0_SE9: J21.5 ; also sheet 1
FTM1_QD_PHA_/_ADC0_SE7: J20.2 ; also sheet 1
FTM1_QD_PHB_/_ADC0_SE6: J20.3 ; also sheet 1
FTM2_QD_PHA_/_TCLK2: J15.2 ; also sheet 1
FTM2_QD_PHB_/_BUSOUT: J15.3 ; also sheet 1
GND: C23.2 J11.3 J12.3 J13.3 J15.4 J16.2 J20.4 J21.1 ; also sheet 1,2,3,4,6,8
N$4: J21.6 R7.1

### Notes on the sheet
- ACTUATORS
- SERVO MOTOR | BLDC controlling ESC
- use the complementary PWM mode
- separe the 7.2V GND
- DON'T FORGET TEST POINTS
- SENSORS
- QUAD ENCODER
- HALL EFFECT SENSOR
- need to modify depending on the sensor selection

## Sheet 8 of 8: GPIO HEADER / CONNECTOR
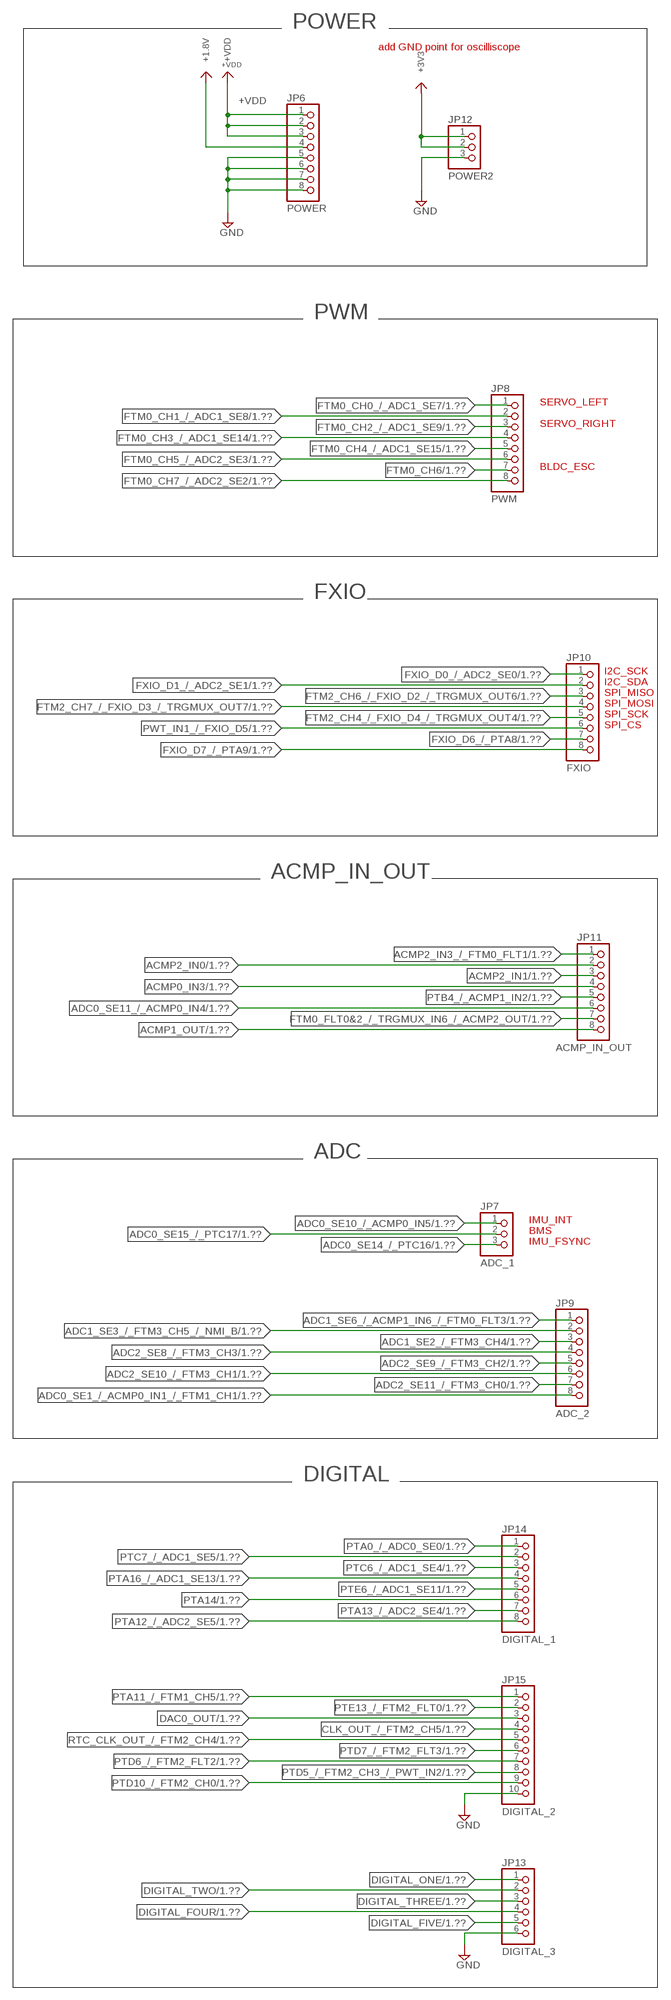
[diagram p8: schematic, sheet 8]

### Parts
JP6  POWER  PINHD-1X8BIG  [1X08-BIG]
JP7  ADC_1  PINHD-1X3  [1X03]
JP8  PWM  PINHD-1X8BIG  [1X08-BIG]
JP9  ADC_2  PINHD-1X8BIG  [1X08-BIG]
JP10  FXIO  PINHD-1X8BIG  [1X08-BIG]
JP11  ACMP_IN_OUT  PINHD-1X8BIG  [1X08-BIG]
JP12  POWER2  PINHD-1X3  [1X03]
JP13  DIGITAL_3  PINHD-1X6B  [1X06-BIG]
JP14  DIGITAL_1  PINHD-1X8BIG  [1X08-BIG]
JP15  DIGITAL_2  PINHD-1X10  [1X10-BIG]

### Nets
+1.8V: JP6.4 ; supply symbol labelled +1V8 ; also sheet 3,4,6
+3V3: JP12.1 JP12.2 ; also sheet 3,5,6
+VDD: JP6.1 JP6.2 JP6.3 ; also sheet 1,3,4,5,6,7
ACMP0_IN3: JP11.4 ; also sheet 1
ACMP1_OUT: JP11.8 ; also sheet 1
ACMP2_IN0: JP11.2 ; also sheet 1
ACMP2_IN1: JP11.3 ; also sheet 1
ACMP2_IN3_/_FTM0_FLT1: JP11.1 ; also sheet 1
ADC0_SE1_/_ACMP0_IN1_/_FTM1_CH1: JP9.8 ; also sheet 1
ADC0_SE10_/_ACMP0_IN5: JP7.1 ; also sheet 1,4
ADC0_SE11_/_ACMP0_IN4: JP11.6 ; also sheet 1
ADC0_SE14_/_PTC16: JP7.3 ; also sheet 1,4
ADC0_SE15_/_PTC17: JP7.2 ; also sheet 1,3
ADC1_SE2_/_FTM3_CH4: JP9.3 ; also sheet 1
ADC1_SE3_/_FTM3_CH5_/_NMI_B: JP9.2 ; also sheet 1
ADC1_SE6_/_ACMP1_IN6_/_FTM0_FLT3: JP9.1 ; also sheet 1
ADC2_SE8_/_FTM3_CH3: JP9.4 ; also sheet 1
ADC2_SE9_/_FTM3_CH2: JP9.5 ; also sheet 1
ADC2_SE10_/_FTM3_CH1: JP9.6 ; also sheet 1
ADC2_SE11_/_FTM3_CH0: JP9.7 ; also sheet 1
CLK_OUT_/_FTM2_CH5: JP15.4 ; also sheet 1
DAC0_OUT: JP15.3 ; also sheet 1
DIGITAL_FIVE: JP13.5 ; also sheet 1
DIGITAL_FOUR: JP13.4 ; also sheet 1
DIGITAL_ONE: JP13.1 ; also sheet 1
DIGITAL_THREE: JP13.3 ; also sheet 1
DIGITAL_TWO: JP13.2 ; also sheet 1
FTM0_CH0_/_ADC1_SE7: JP8.1 ; also sheet 1,7
FTM0_CH1_/_ADC1_SE8: JP8.2 ; also sheet 1
FTM0_CH2_/_ADC1_SE9: JP8.3 ; also sheet 1,7
FTM0_CH3_/_ADC1_SE14: JP8.4 ; also sheet 1
FTM0_CH4_/_ADC1_SE15: JP8.5 ; also sheet 1
FTM0_CH5_/_ADC2_SE3: JP8.6 ; also sheet 1
FTM0_CH6: JP8.7 ; also sheet 1,7
FTM0_CH7_/_ADC2_SE2: JP8.8 ; also sheet 1
FTM0_FLT0&2_/_TRGMUX_IN6_/_ACMP2_OUT: JP11.7 ; also sheet 1
FTM2_CH4_/_FXIO_D4_/_TRGMUX_OUT4: JP10.5 ; also sheet 1,6
FTM2_CH6_/_FXIO_D2_/_TRGMUX_OUT6: JP10.3 ; also sheet 1,6
FTM2_CH7_/_FXIO_D3_/_TRGMUX_OUT7: JP10.4 ; also sheet 1,6
FXIO_D0_/_ADC2_SE0: JP10.1 ; also sheet 1,6
FXIO_D1_/_ADC2_SE1: JP10.2 ; also sheet 1,6
FXIO_D6_/_PTA8: JP10.7 ; also sheet 1
FXIO_D7_/_PTA9: JP10.8 ; also sheet 1
GND: JP6.5 JP6.6 JP6.7 JP6.8 JP12.3 JP13.6 JP15.10 ; also sheet 1,2,3,4,6,7
PTA0_/_ADC0_SE0: JP14.1 ; also sheet 1
PTA11_/_FTM1_CH5: JP15.1 ; also sheet 1
PTA12_/_ADC2_SE5: JP14.8 ; also sheet 1
PTA13_/_ADC2_SE4: JP14.7 ; also sheet 1
PTA14: JP14.6 ; also sheet 1
PTA16_/_ADC1_SE13: JP14.4 ; also sheet 1
PTB4_/_ACMP1_IN2: JP11.5 ; also sheet 1
PTC6_/_ADC1_SE4: JP14.3 ; also sheet 1
PTC7_/_ADC1_SE5: JP14.2 ; also sheet 1
PTD5_/_FTM2_CH3_/_PWT_IN2: JP15.8 ; also sheet 1
PTD6_/_FTM2_FLT2: JP15.7 ; also sheet 1
PTD7_/_FTM2_FLT3: JP15.6 ; also sheet 1
PTD10_/_FTM2_CH0: JP15.9 ; also sheet 1
PTE6_/_ADC1_SE11: JP14.5 ; also sheet 1
PTE13_/_FTM2_FLT0: JP15.2 ; also sheet 1
PWT_IN1_/_FXIO_D5: JP10.6 ; also sheet 1,6
RTC_CLK_OUT_/_FTM2_CH4: JP15.5 ; also sheet 1

### Notes on the sheet
- POWER
- add GND point for oscilliscope
- PWM
- SERVO_LEFT
- SERVO_RIGHT
- BLDC_ESC
- FXIO
- I2C_SCK
- I2C_SDA
- SPI_MISO
- SPI_MOSI
- SPI_SCK
- SPI_CS
- ACMP_IN_OUT
- ADC
- IMU_INT
- BMS
- IMU_FSYNC
- DIGITAL

## Library data of the parts
C1-C9 C12-C16 C18-C28 = RobotRacing2019_Master:CAP0603
C11 C17 C29 = RobotRacing2019_Master:CAP0603; SPICEPREFIX: C
CN1 = RobotRacing2019_Master:MIRCO_B
D1-D8 = RobotRacing2019_Master:LED0603
DEBUG/RACE RC/AUTO SW1 = special:SW_DIP-1: DIP SWITCH
FB1 = RobotRacing2019_Master:FERRITE_BEAD
IC1 = RobotRacing2019_Master:OR_SC70-5
J2-J4 J7 J9 J10 J15 J17 J18 J20 = RobotRacing2019_Master:PINHEAD-4-VERTICAL
J5 J6 J8 J21 J22 = RobotRacing2019_Master:PINHEAD-6-VERTICAL
J11-J13 = RobotRacing2019_Master:PINHEAD-3-VERTICAL
J14 J16 J19 = RobotRacing2019_Master:PINHEAD-2-VERTICAL
JP1-JP5 JP7 JP12 = adafruit:PINHD-1X3: PIN HEADER
JP6 JP8-JP11 JP14 = adafruit:PINHD-1X8: PIN HEADER
JP13 = adafruit:PINHD-1X6: PIN HEADER
JP15 = adafruit:PINHD-1X10: Pin header 1x10 0.1" spacing With round pins
L1 = RobotRacing2019_Master:IND0603
L2 = RobotRacing2019_Master:CHOKE0603
Q1 Q4-Q8 = RobotRacing2019_Master:NMOS_SOT23
Q3 = RobotRacing2019_Master:PMOS_SOT23
R1-R7 R9-R16 R18 R20-R41 R43 R44 R46-R49 = RobotRacing2019_Master:RES0603
S1 S2 = RobotRacing2019_Master:TACT_SWITCH_6X6_SMT
S3 = RobotRacing2019_Master:M9040P: TOGGLE SWITCH Marquardt
U2 = microbuilder:FT232RL: FTDI FT232RL USB TO RS232 Converter Digikey: 768-1007-1-ND
U3 = RobotRacing2019_Master:ICM-20948: Axis=3 Axis Gyro+3 Axis Accel+Compass. Pin For Pin With m; AVAILABILITY: Unavailable; DESCRIPTION: 9 Axis=3 Axis Gyro+3 Axis Accel+Compass. Pin For Pin With m; MF: TDK InvenSense; MP: ICM-20948; PACKAGE: QFN-24 InvenSense; PRICE: None
U4 = RobotRacing2019_Master:PCA9306: Bidirectional I2C level shifter. NOT compatible with all available part number pinout schemes- DOUBLE CHECK!!!; AVAILABILITY: Unavailable; DESCRIPTION: Dual Bi-Directional I2C-Bus and SMBus Voltage Level-Translator; MF: Texas Instruments; MP: PCA9306; PACKAGE: SSOP-8 Texas Instruments; PRICE: None
U$1 = RobotRacing2019_Master:MKE14F512LL16: ARM® Cortex®-M4F Kinetis KE1xF Microcontroller IC 32-Bit 168MHz 512KB (512K x 8) FLASH 100-LQFP (14x14)
U$12 = RobotRacing2019_Master:SWD_1.27MM
U$38 = RobotRacing2019_Master:BOARD_INFO
U$44 = RobotRacing2019_Master:TEAM_LOGO
VR1 = RobotRacing2019_Master:MIC5501
VR2 = RobotRacing2019_Master:ADP121